# EAGLE design RobOnPi (EAGLE 7.7.0)

## Sheet 1 of 2
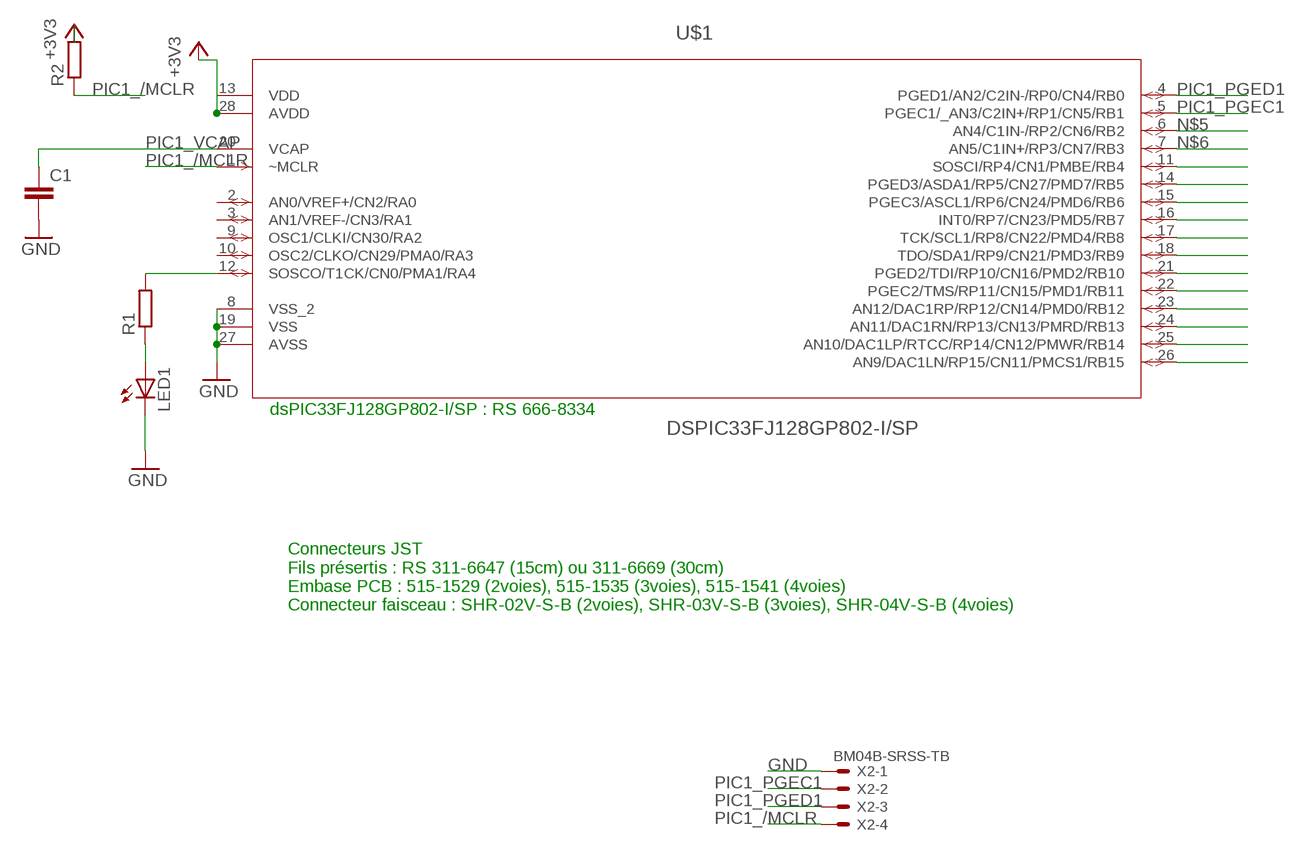
[diagram p0: schematic, sheet 1]

### Parts
C1  C-EUC1206  [C1206]
LED1  LEDSML1206  [SML1206]
R1  R-EU_M1206  [M1206]
R2  R-EU_M1206  [M1206]
U$1  DSPIC33FJ128GP802-I/SP  [DIP254P762X508-28]
X2  BM04B-SRSS-TB  [BM04B-SRSS-TB]

### Nets
+3V3: R2.2 U$1.13(VDD) U$1.28(AVDD)
GND: C1.2 LED1.C U$1.8(VSS_2) U$1.19(VSS) U$1.27(AVSS) X2.1
N$1: LED1.A R1.1
N$2: R1.2 U$1.12(SOSCO/T1CK/CN0/PMA1/RA4)
N$5: U$1.6(AN4/C1IN-/RP2/CN6/RB2)
N$6: U$1.7(AN5/C1IN+/RP3/CN7/RB3)
N$7: U$1.11(SOSCI/RP4/CN1/PMBE/RB4)
N$8: U$1.14(PGED3/ASDA1/RP5/CN27/PMD7/RB5)
N$9: U$1.15(PGEC3/ASCL1/RP6/CN24/PMD6/RB6)
N$10: U$1.16(INT0/RP7/CN23/PMD5/RB7)
N$11: U$1.17(TCK/SCL1/RP8/CN22/PMD4/RB8)
N$12: U$1.18(TDO/SDA1/RP9/CN21/PMD3/RB9)
N$13: U$1.21(PGED2/TDI/RP10/CN16/PMD2/RB10)
N$14: U$1.22(PGEC2/TMS/RP11/CN15/PMD1/RB11)
N$15: U$1.23(AN12/DAC1RP/RP12/CN14/PMD0/RB12)
N$16: U$1.24(AN11/DAC1RN/RP13/CN13/PMRD/RB13)
N$17: U$1.25(AN10/DAC1LP/RTCC/RP14/CN12/PMWR/RB14)
N$18: U$1.26(AN9/DAC1LN/RP15/CN11/PMCS1/RB15)
PIC1_/MCLR: R2.1 U$1.1(~MCLR) X2.4
PIC1_PGEC1: U$1.5(PGEC1/_AN3/C2IN+/RP1/CN5/RB1) X2.2
PIC1_PGED1: U$1.4(PGED1/AN2/C2IN-/RP0/CN4/RB0) X2.3
PIC1_VCAP: C1.1 U$1.20(VCAP)
Unconnected: U$1.2(AN0/VREF+/CN2/RA0) U$1.3(AN1/VREF-/CN3/RA1) U$1.9(OSC1/CLKI/CN30/RA2) U$1.10(OSC2/CLKO/CN29/PMA0/RA3)

### Notes on the sheet
- dsPIC33FJ128GP802-I/SP : RS 666-8334
- Connecteurs JST
  Fils présertis : RS 311-6647 (15cm) ou 311-6669 (30cm)
  Embase PCB : 515-1529 (2voies), 515-1535 (3voies), 515-1541 (4voies)
  Connecteur faisceau : SHR-02V-S-B (2voies), SHR-03V-S-B (3voies), SHR-04V-S-B (4voies)

## Sheet 2 of 2

## Library data of the parts
C1 = resistor:C-EU: CAPACITOR, European symbol
LED1 = led:LED: LED OSRAM: - CHIPLED LG R971, LG N971, LY N971, LG Q971, LY Q971, LO R971, LY R971 LH N974, LH R974 LS Q976, LO Q976, LY Q976 LO Q996 - Hyper CHIPLED LW Q18S LB Q993, LB Q99A, LB R99A - SideLED LS A670, LO A670, LY A670, LG A670, LP A670 LB A673, LV A673, LT A673, LW A673 LH A674 LY A675 LS A676, LA A676, LO A676, LY A676, LW A676 LS A679, LY A679, LG A679 - Hyper Micro SIDELED® LS Y876, LA Y876, LO Y876, LY Y876 LT Y87S - SmartLED LW L88C, LW L88S LB L89C, LB L89S, LG L890 LS L89K, LO L89K, LY L89K LS L896, LA L896, LO L896, LY L896 - TOPLED LS T670, LO T670, LY T670, LG T670, LP T670 LSG T670, LSP T670, LSY T670, LOP T670, LYG T670 LG T671, LOG T671, LSG T671 LB T673, LV T673, LT T673, LW T673 LH T674 LS T676, LA T676, LO T676, LY T676, LB T676, LH T676, LSB T676, LW T676 LB T67C, LV T67C, LT T67C, LS T67K, LO T67K, LY T67K, LW E67C LS E67B, LA E67B, LO E67B, LY E67B, LB E67C, LV E67C, LT E67C LW T67C LS T679, LY T679, LG T679 LS T770, LO T770, LY T770, LG T770, LP T770 LB T773, LV T773, LT T773, LW T773 LH T774 LS E675, LA E675, LY E675, LS T675 LS T776, LA T776, LO T776, LY T776, LB T776 LHGB T686 LT T68C, LB T68C - Hyper Mini TOPLED® LB M676 - Mini TOPLED Santana® LG M470 LS M47K, LO M47K, LY M47K Source: http://www.osram.convergy.de LUXEON: - LUMILED® LXK2-PW12-R00, LXK2-PW12-S00, LXK2-PW14-U00, LXK2-PW14-V00 LXK2-PM12-R00, LXK2-PM12-S00, LXK2-PM14-U00 LXK2-PE12-Q00, LXK2-PE12-R00, LXK2-PE12-S00, LXK2-PE14-T00, LXK2-PE14-U00 LXK2-PB12-K00, LXK2-PB12-L00, LXK2-PB12-M00, LXK2-PB14-N00, LXK2-PB14-P00, LXK2-PB14-Q00 LXK2-PR12-L00, LXK2-PR12-M00, LXK2-PR14-Q00, LXK2-PR14-R00 LXK2-PD12-Q00, LXK2-PD12-R00, LXK2-PD12-S00 LXK2-PH12-R00, LXK2-PH12-S00 LXK2-PL12-P00, LXK2-PL12-Q00, LXK2-PL12-R00 Source: www.luxeon.com KINGBRIGHT: KA-3528ASYC Source: www.kingbright.com
R1 R2 = resistor:R-EU_: RESISTOR, European symbol
U$1 = Microchip_By_element14_Batch_1:DSPIC33FJ128GP802-I/SP: 16-Bit Digital Signal Controllers; DESCRIPTION: IC, DSC; MPN: DSPIC33FJ128GP802-I/SP; OC_FARNELL: 1576801; OC_NEWARK: 39M8119; PACKAGE: DIP-28; SUPPLIER: Microchip
X2 = con-jst2:?M04B-SRSS-TB: Disconnectable Crimp style connector, 1.0mm pitch 4 contacts

## Board
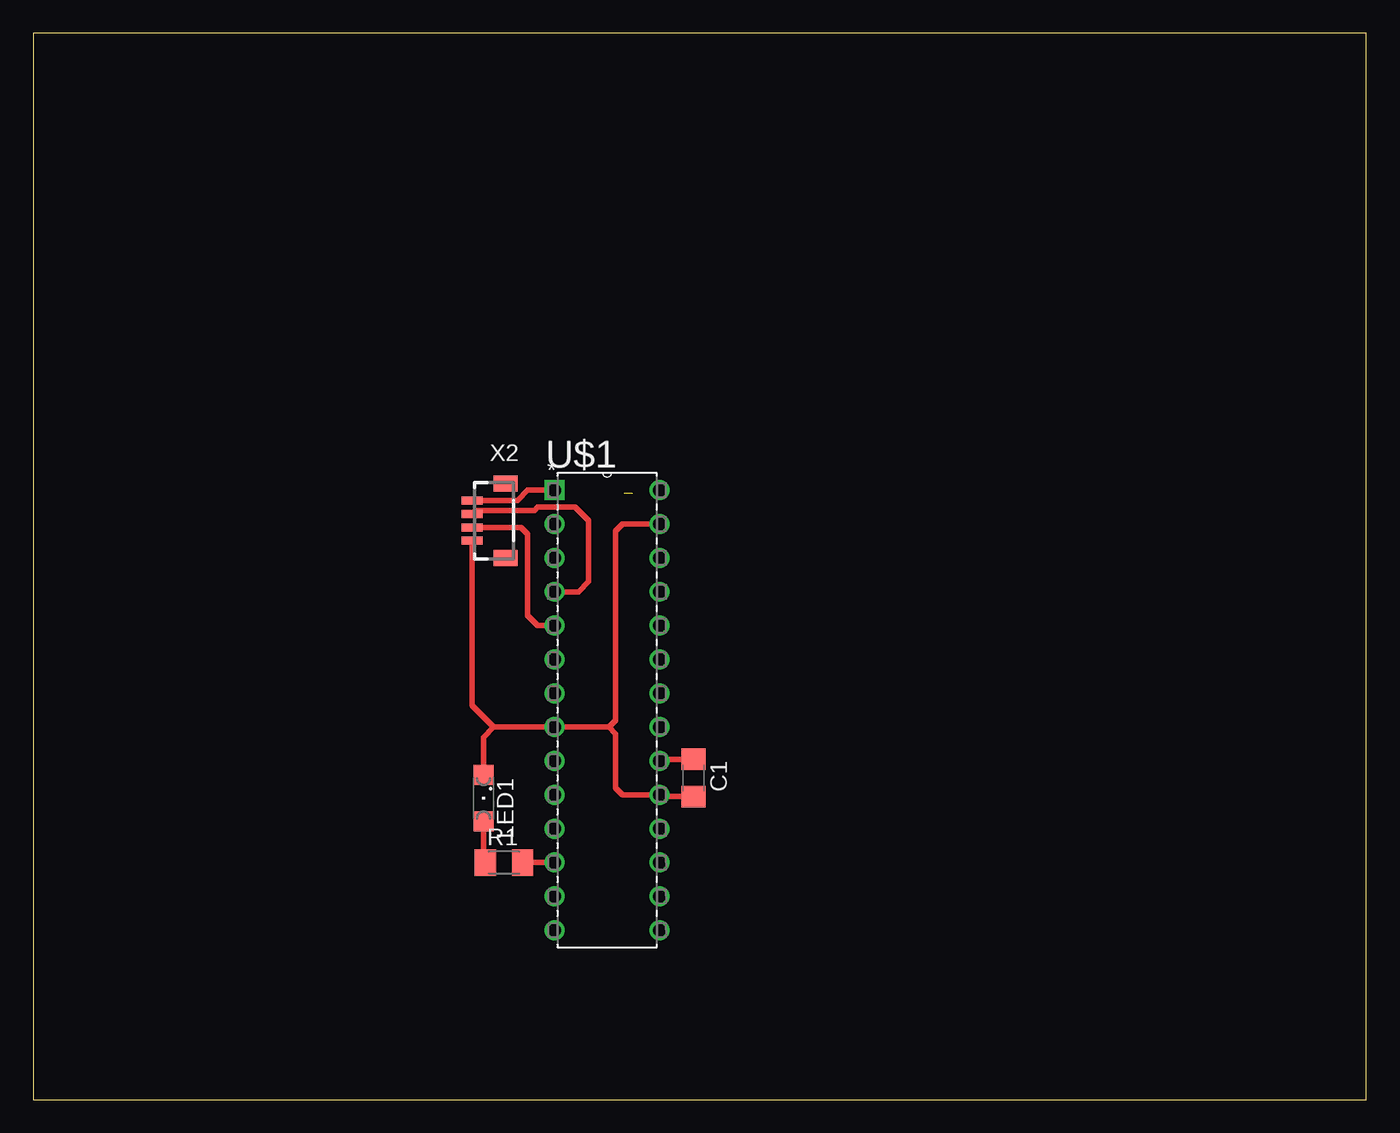
[diagram p1: board, top side]
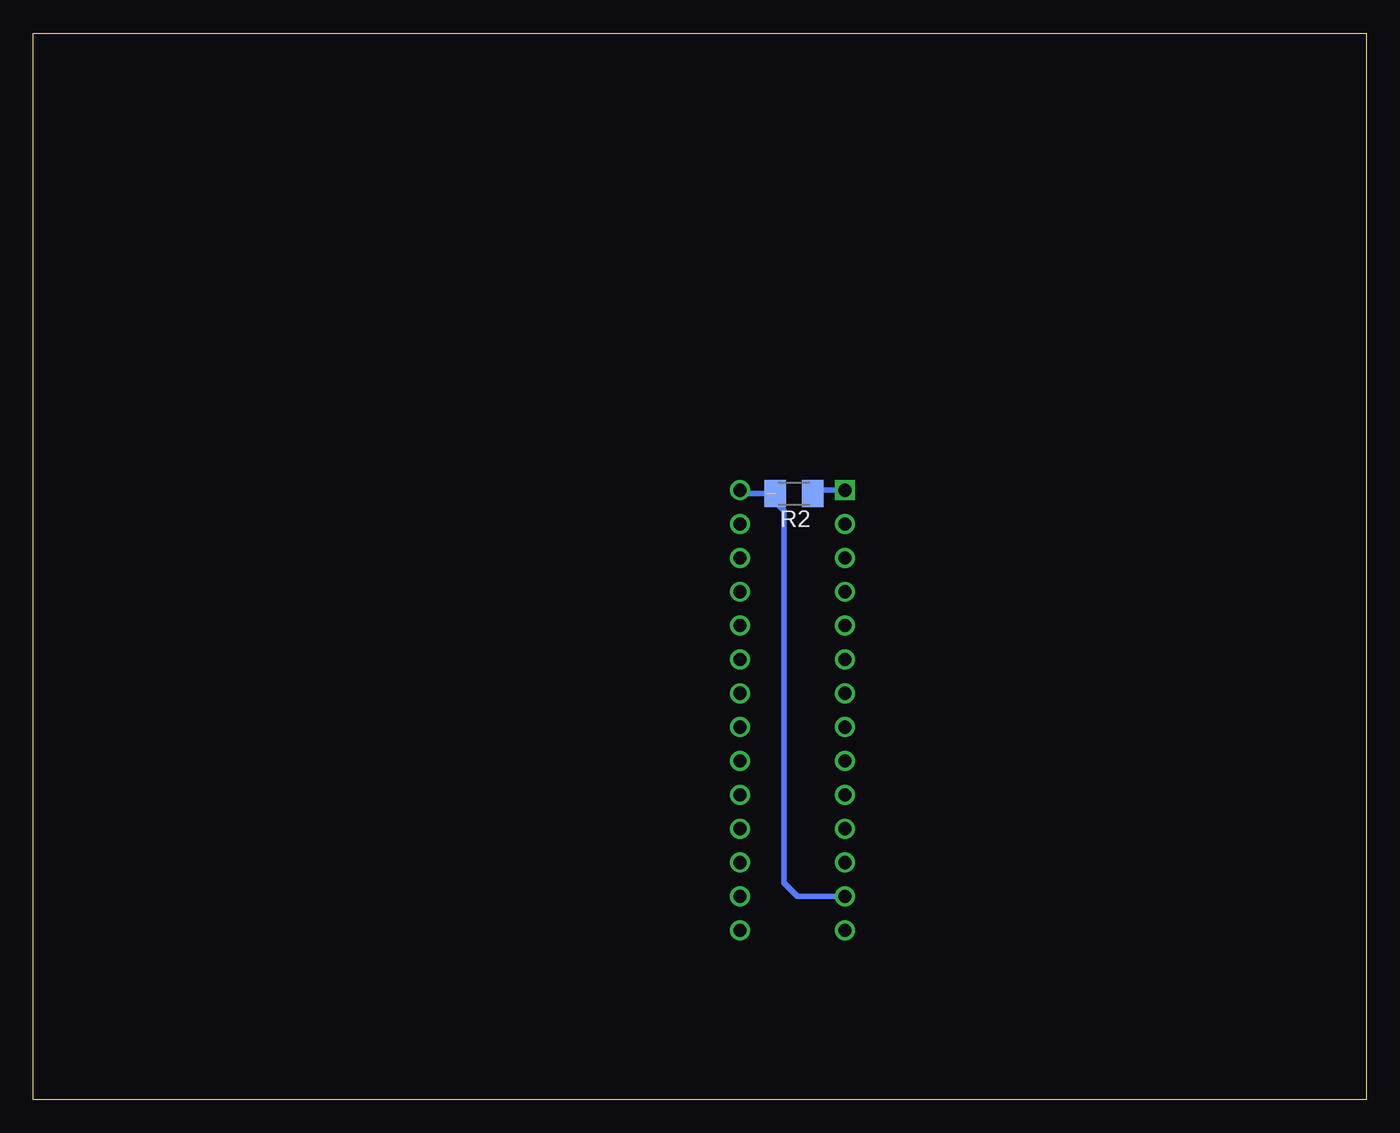
[diagram p2: board, bottom side, seen from below]

Size 100 x 80 mm. Coordinates in mm from the lower left corner, seen from the top.
Outline: 0,0 100,0 100,80 0,80 0,0
Copper layers (1*16): Top 0.035mm / dielectric 1.5mm / Bottom 0.035mm
Design rules "default": minimum track width 10mil, minimum drill 24mil, track to track 8mil, track to pad 8mil, pad to pad 8mil, via to via 8mil, smd to smd 8mil, copper to edge 40mil, drill to drill 8mil, minimum pad ring 10mil, minimum via ring 8mil, stop-mask expansion 4mil, vias tented up to drill 0mil, thermal gap 10mil

### Footprints (pad centres in the part's own frame; a part is rotated, then mirrored left to right if it is on the bottom)
C1206 = smd 1.6 x 1.8: 1 -1.4,0; 2 1.4,0
SML1206 = smd 1.5 x 1.5: A 1.75,0; C -1.75,0
M1206 = smd 1.6 x 2: 1 -1.4,0; 2 1.4,0
DIP254P762X508-28 = drill 0.991 square: 1 -7.874,33.02 | drill 0.991: 2 -7.874,30.48; 3 -7.874,27.94; 4 -7.874,25.4; 5 -7.874,22.86; 6 -7.874,20.32; 7 -7.874,17.78; 8 -7.874,15.24; 9 -7.874,12.7; 10 -7.874,10.16; 11 -7.874,7.62; 12 -7.874,5.08; 13 -7.874,2.54; 14 -7.874,0; 15 0,0; 16 0,2.54; 17 0,5.08; 18 0,7.62; 19 0,10.16; 20 0,12.7; 21 0,15.24; 22 0,17.78; 23 0,20.32; 24 0,22.86; 25 0,25.4; 26 0,27.94; 27 0,30.48; 28 0,33.02
BM04B-SRSS-TB = smd 0.6 x 1.55: 1 1.5,-1.625; 2 0.5,-1.625; 3 -0.5,-1.625; 4 -1.5,-1.625 | smd 1.2 x 1.8: FIT@1 2.8,0.9; FIT@2 -2.8,0.9

### Placement (x,y rotation side)
C1  49.53,24.13 270 top
LED1  33.78,22.61 270 top
R1  35.31,17.78 0 top
R2  42.93,45.47 180 bottom
U$1  46.99,12.7 0 top
X2  34.54,43.43 270 top

### Tracks (layer width: path | path; a pad name or v marks a point on that pad's centre or on a via)
+3V3  (1 unrouted)
  Bottom 0.406: U$1.13 42.67,15.24 43.69,16.26 43.69,44.2 44.96,45.47 46.74,45.47 U$1.28
GND
  Top 0.406: C1.2 47.12,22.73 U$1.19 44.2,22.86 43.69,23.37 43.69,27.43 43.18,27.94 | LED1.C 33.78,27.18 34.54,27.94 | 34.54,27.94 U$1.8 43.18,27.94 | 43.18,27.94 43.69,28.45 43.69,42.67 44.2,43.18 U$1.27 | X2.1 32.92,29.57 34.54,27.94
N$1
  Top 0.406: LED1.A 33.78,17.9 R1.1
N$2
  Top 0.406: R1.2 U$1.12
PIC1_/MCLR
  Top 0.406: X2.4 32.94,44.96 36.32,44.96 37.08,45.72 U$1.1
  Bottom 0.406: U$1.1 41.53,45.72 R2.1
PIC1_PGEC1
  Top 0.406: X2.2 33.02,42.93 36.58,42.93 37.08,42.42 37.08,36.32 37.85,35.56 U$1.5
PIC1_PGED1
  Top 0.406: X2.3 33.18,44.2 37.59,44.2 37.85,44.45 40.64,44.45 41.66,43.43 41.66,38.86 40.89,38.1 U$1.4
PIC1_VCAP
  Top 0.406: C1.1 47.12,25.53 U$1.20